# EAGLE design Power_2019_2 (EAGLE 9.6.2)
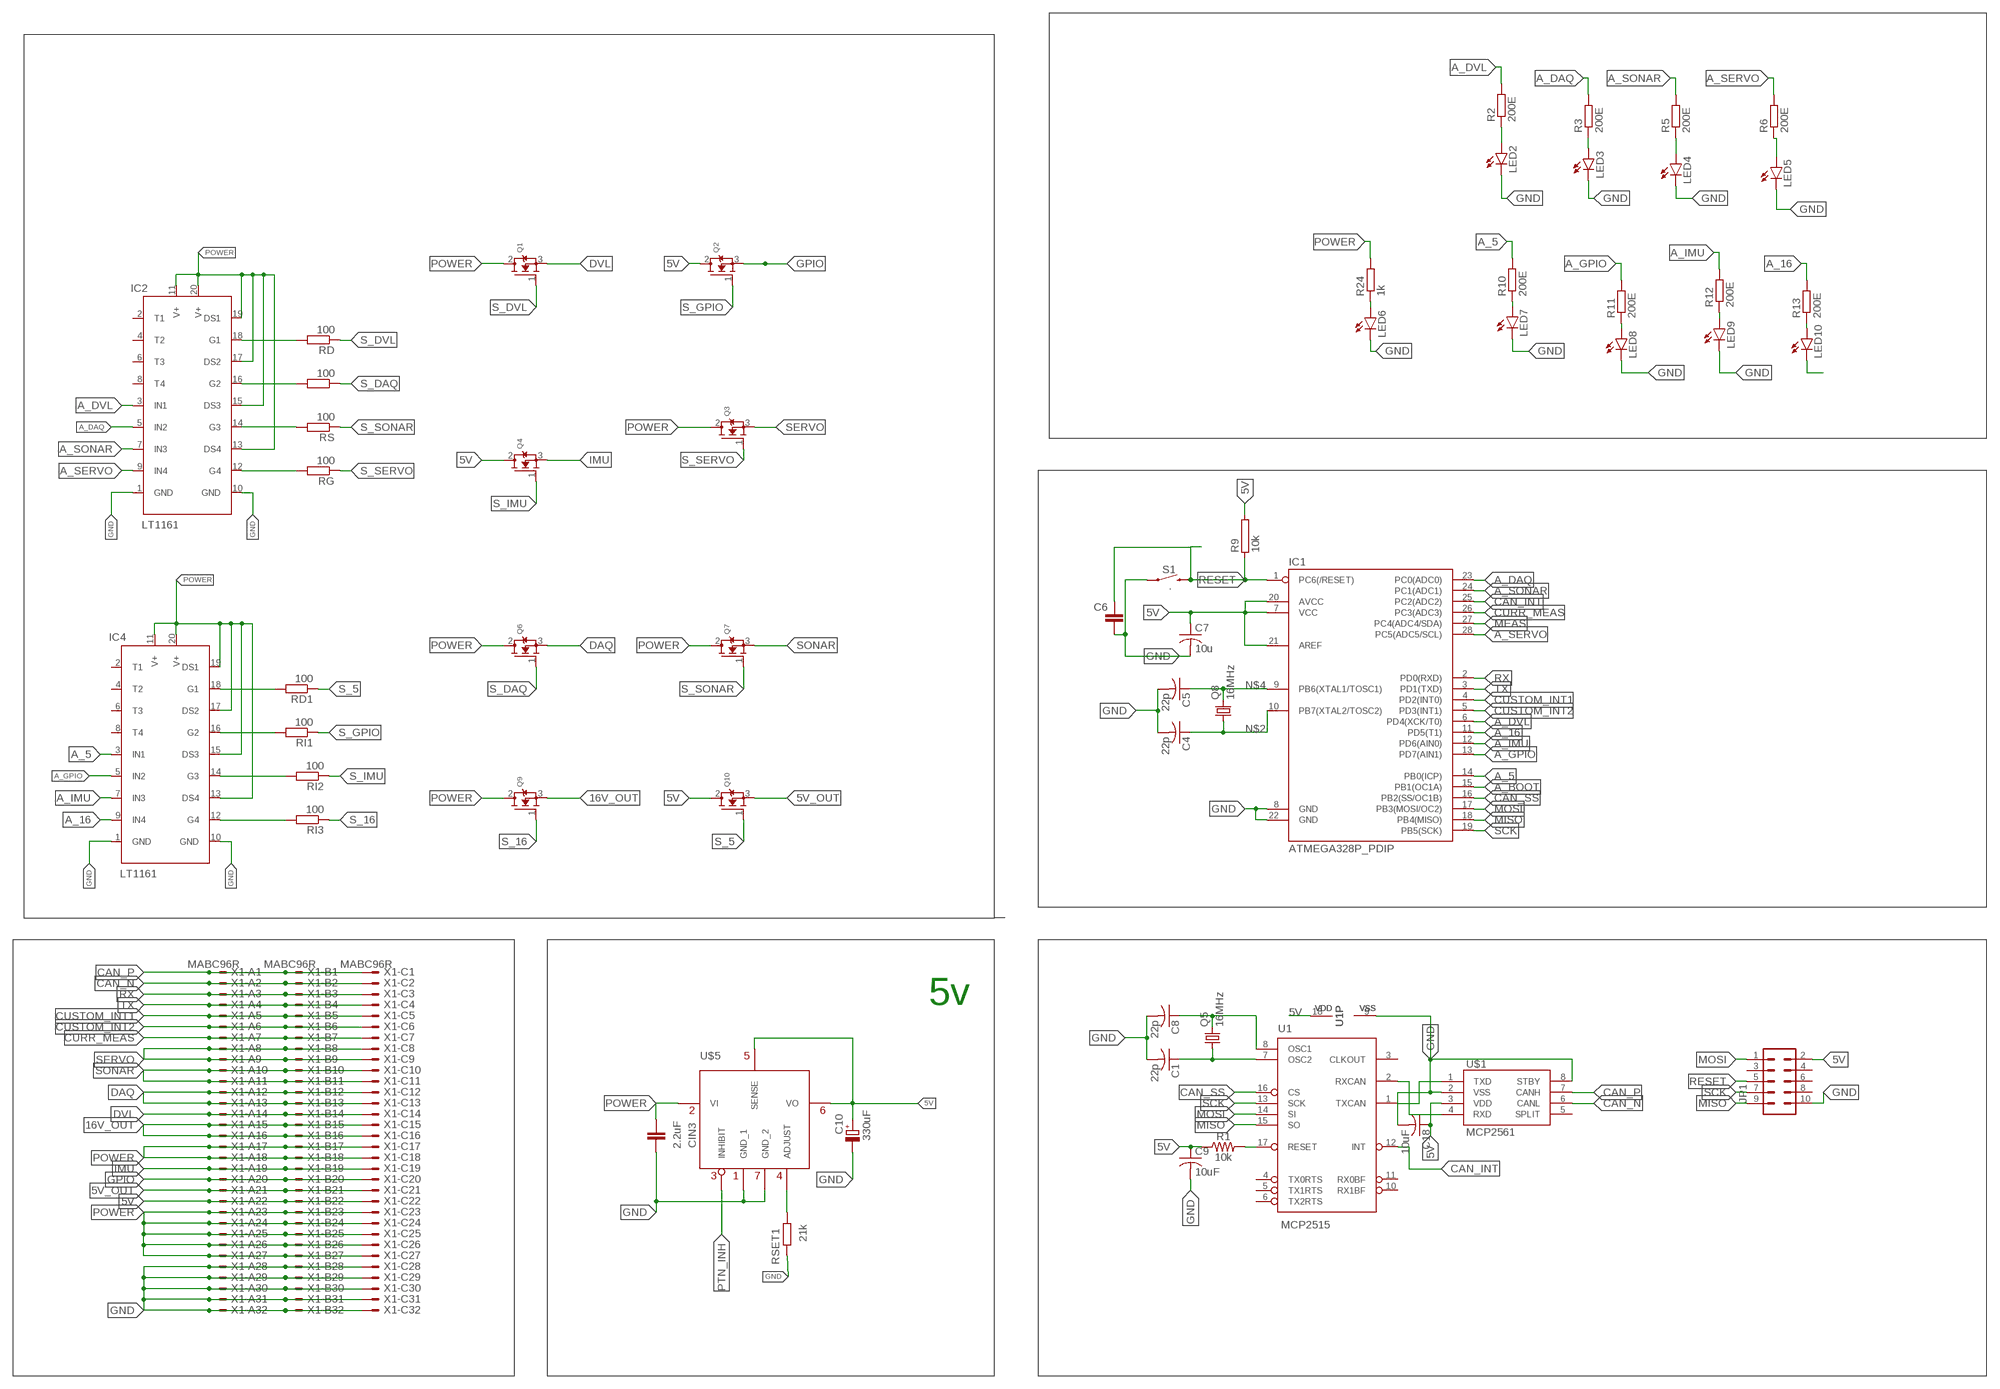
[diagram p0: schematic, sheet 1]

## Parts
C1  22p  C-US025-024X044  [C025-024X044]
C4  22p  C-US025-024X044  [C025-024X044]
C5  22p  C-US025-024X044  [C025-024X044]
C6  C-EU025-050X050  [C025-050X050]
C7  10u  C-US025-050X050  [C025-050X050]
C8  22p  C-US025-024X044  [C025-024X044]
C9  10uF  C-US025-050X050  [C025-050X050]
C10  330uF  CPOL-EUE2.5-5  [E2,5-5]
C18  10uF  C-US025-050X050  [C025-050X050]
CIN3  2.2uF  C-EUC0805  [C0805]
IC1  ATMEGA328P_PDIP  [DIL28-3]
IC2  LT1161  ROBOSUB_LINEAR-TECHNOLOGY_LT1161_QUAD-HIGH-SIDE-MOSFET-DRIVER_LT1161-SO20SW  [ROBOSUB_LINEAR-TECHNOLOGY_LT1161_QUAD-HIGH-SIDE-MOSFET-DRIVER_SO20]
IC4  LT1161  ROBOSUB_LINEAR-TECHNOLOGY_LT1161_QUAD-HIGH-SIDE-MOSFET-DRIVER_LT1161-SO20SW  [ROBOSUB_LINEAR-TECHNOLOGY_LT1161_QUAD-HIGH-SIDE-MOSFET-DRIVER_SO20]
JP1  CONN_05X2SHD  [2X5-SHROUDED]
LED2  LEDCHIPLED_0805  [CHIPLED_0805]
LED3  LEDCHIPLED_0805  [CHIPLED_0805]
LED4  LEDCHIPLED_0805  [CHIPLED_0805]
LED5  LEDCHIPLED_0805  [CHIPLED_0805]
LED6  LEDCHIPLED_0805  [CHIPLED_0805]
LED7  LEDCHIPLED_0805  [CHIPLED_0805]
LED8  LEDCHIPLED_0805  [CHIPLED_0805]
LED9  LEDCHIPLED_0805  [CHIPLED_0805]
LED10  LEDCHIPLED_0805  [CHIPLED_0805]
Q1  MOSFET-NGDS_TO220V  [TO220V]
Q2  MOSFET-NGDS_TO220V  [TO220V]
Q3  MOSFET-NGDS_TO220V  [TO220V]
Q4  MOSFET-NGDS_TO220V  [TO220V]
Q5  16MHz  CRYSTALHC49S  [HC49/S]
Q6  MOSFET-NGDS_TO220V  [TO220V]
Q7  MOSFET-NGDS_TO220V  [TO220V]
Q8  16MHz  CRYSTALHC49S  [HC49/S]
Q9  MOSFET-NGDS_TO220V  [TO220V]
Q10  MOSFET-NGDS_TO220V  [TO220V]
R1  10k  RESISTORAXIAL-0.3  [AXIAL-0.3]
R2  200E  R-EU_M0805  [M0805]
R3  200E  R-EU_M0805  [M0805]
R5  200E  R-EU_M0805  [M0805]
R6  200E  R-EU_M0805  [M0805]
R9  10k  RRS1/4  [RS1/4]
R10  200E  R-EU_M0805  [M0805]
R11  200E  R-EU_M0805  [M0805]
R12  200E  R-EU_M0805  [M0805]
R13  200E  R-EU_M0805  [M0805]
R24  1k  R-EU_M0805  [M0805]
RD  100  R-EU_M0805  [M0805]
RD1  100  R-EU_M0805  [M0805]
RG  100  R-EU_M0805  [M0805]
RI  100  R-EU_M0805  [M0805]
RI1  100  R-EU_M0805  [M0805]
RI2  100  R-EU_M0805  [M0805]
RI3  100  R-EU_M0805  [M0805]
RS  100  R-EU_M0805  [M0805]
RSET1  21k  R-EU_M0805  [M0805]
S1  .  MOMENTARY-SWITCH-SPST-PTH-6.0MM  [TACTILE_SWITCH_PTH_6.0MM]
U1  MCP2515  MCP2515(MCP2510)P  [DIP18]
U$1  MCP2561  [DIP08]
U$5  PTN78060WAH  [PTN78060WAH]
X1  MABC96R  [MABC96R]

## Nets
5V: C7.1 C9.1 C10.+ C18.1 IC1.7(VCC) IC1.20(AVCC) IC1.21(AREF) JP1.2 Q2.2(D) Q4.2(D) Q10.2(D) R1.P$1 R9.2 U1.18(VDD) U$1.3(VDD) U$5.5(SENSE) U$5.6(VO) X1.A22 X1.B22 X1.C22
5V_OUT: Q10.3(S) X1.A21 X1.B21 X1.C21
16V_OUT: Q9.3(S) X1.A15 X1.A16 X1.B15 X1.B16 X1.C15 X1.C16
A_5: IC1.14(PB0(ICP)) IC4.3(IN1) R10.2
A_16: IC1.11(PD5(T1)) IC4.9(IN4) R13.2
A_BOOT: IC1.15(PB1(OC1A))
A_DAQ: IC1.23(PC0(ADC0)) IC2.5(IN2) R3.2
A_DVL: IC1.6(PD4(XCK/T0)) IC2.3(IN1) R2.2
A_GPIO: IC1.13(PD7(AIN1)) IC4.5(IN2) R11.2
A_IMU: IC1.12(PD6(AIN0)) IC4.7(IN3) R12.2
A_SERVO: IC1.28(PC5(ADC5/SCL)) IC2.9(IN4) R6.2
A_SONAR: IC1.24(PC1(ADC1)) IC2.7(IN3) R5.2
CAN_INT: IC1.25(PC2(ADC2)) U1.12(INT)
CAN_N [can]: U$1.6(CANL) X1.A2 X1.B2 X1.C2
CAN_P [can]: U$1.7(CANH) X1.A1 X1.B1 X1.C1
CAN_SS: IC1.16(PB2(SS/OC1B)) U1.16(CS)
CURR_MEAS: IC1.26(PC3(ADC3)) X1.A7 X1.B7 X1.C7
CUSTOM_INT1: IC1.4(PD2(INT0)) X1.A5 X1.B5 X1.C5
CUSTOM_INT2: IC1.5(PD3(INT1)) X1.A6 X1.B6 X1.C6
D: IC2.12(G4) RG.2
DAQ: Q6.3(S) X1.A12 X1.A13 X1.B12 X1.B13 X1.C12 X1.C13
DVL: Q1.3(S) X1.A14 X1.B14 X1.C14
G: IC2.18(G1) RD.2
G1: IC4.18(G1) RD1.2
GND: C1.2 C4.2 C5.2 C6.2 C7.2 C8.2 C9.2 C10.- C18.2 CIN3.1 IC1.8(GND) IC1.22(GND) IC2.1(GND) IC2.10(GND) IC4.1(GND) IC4.10(GND) JP1.10 LED2.C LED3.C LED4.C LED5.C LED6.C LED7.C LED8.C LED9.C LED10.C RSET1.2 S1.1 U1.9(VSS) U$1.2(VSS) U$1.8(STBY) U$5.1(GND_1) U$5.7(GND_2) X1.A28 X1.A29 X1.A30 X1.A31 X1.A32 X1.B28 X1.B29 X1.B30 X1.B31 X1.B32 X1.C28 X1.C29 X1.C30 X1.C31 X1.C32
GPIO: Q2.3(S) X1.A20 X1.B20 X1.C20
I: IC2.14(G3) RS.2
IMU: Q4.3(S) X1.A19 X1.B19 X1.C19
MEAS: IC1.27(PC4(ADC4/SDA))
MISO: IC1.18(PB4(MISO)) JP1.9 U1.15(SO)
MOSI: IC1.17(PB3(MOSI/OC2)) JP1.1 U1.14(SI)
N$1: LED2.A R2.1
N$2: C4.1 IC1.10(PB7(XTAL2/TOSC2)) Q8.1
N$3: U1.1(TXCAN) U$1.1(TXD)
N$4: C5.1 IC1.9(PB6(XTAL1/TOSC1)) Q8.2
N$6: LED3.A R3.1
N$7: U1.2(RXCAN) U$1.4(RXD)
N$8: R1.P$2 U1.17(RESET)
N$9: C1.1 Q5.1 U1.7(OSC2)
N$10: C8.1 Q5.2 U1.8(OSC1)
N$11: RSET1.1 U$5.4(ADJUST)
N$13: LED4.A R5.1
N$15: LED5.A R6.1
N$17: LED7.A R10.1
N$18: LED6.A R24.1
N$21: LED8.A R11.1
N$23: LED9.A R12.1
N$25: LED10.A R13.1
N$29: IC4.14(G3) RI2.2
N$30: IC4.12(G4) RI3.2
POWER: CIN3.2 IC2.11(V+) IC2.13(DS4) IC2.15(DS3) IC2.17(DS2) IC2.19(DS1) IC2.20(V+) IC4.11(V+) IC4.13(DS4) IC4.15(DS3) IC4.17(DS2) IC4.19(DS1) IC4.20(V+) Q1.2(D) Q3.2(D) Q6.2(D) Q7.2(D) Q9.2(D) R24.2 U$5.2(VI) X1.A17 X1.A18 X1.A23 X1.A24 X1.A25 X1.A26 X1.A27 X1.B17 X1.B18 X1.B23 X1.B24 X1.B25 X1.B26 X1.B27 X1.C17 X1.C18 X1.C23 X1.C24 X1.C25 X1.C26 X1.C27
PTN_INH: U$5.3(INHIBIT)
RESET: C6.1 IC1.1(PC6(/RESET)) JP1.5 R9.1 S1.3
RX: IC1.2(PD0(RXD)) X1.A3 X1.B3 X1.C3
S: IC2.16(G2) RI.2
S1: IC4.16(G2) RI1.2
S_5: Q10.1(G) RD1.1
S_16: Q9.1(G) RI3.1
S_DAQ: Q6.1(G) RI.1
S_DVL: Q1.1(G) RD.1
S_GPIO: Q2.1(G) RI1.1
S_IMU: Q4.1(G) RI2.1
S_SERVO: Q3.1(G) RG.1
S_SONAR: Q7.1(G) RS.1
SCK: IC1.19(PB5(SCK)) JP1.7 U1.13(SCK)
SERVO: Q3.3(S) X1.A8 X1.A9 X1.B8 X1.B9 X1.C8 X1.C9
SONAR: Q7.3(S) X1.A10 X1.A11 X1.B10 X1.B11 X1.C10 X1.C11
TX: IC1.3(PD1(TXD)) X1.A4 X1.B4 X1.C4
Unconnected: IC2.2(T1) IC2.4(T2) IC2.6(T3) IC2.8(T4) IC4.2(T1) IC4.4(T2) IC4.6(T3) IC4.8(T4) JP1.3 JP1.4 JP1.6 JP1.8 U1.3(CLKOUT) U1.4(TX0RTS) U1.5(TX1RTS) U1.6(TX2RTS) U1.10(RX1BF) U1.11(RX0BF) U$1.5(SPLIT)

## Notes on the sheet
- 5v

## Library data of the parts
C1 C4 C5 C7 C8 = resistor:C-US: CAPACITOR, American symbol
C6 CIN3 = rcl:C-EU: CAPACITOR, European symbol; SPICEPREFIX: C
C9 C18 = adafruit:C-US: CAPACITOR, American symbol
C10 = rcl:CPOL-EU: POLARIZED CAPACITOR, European symbol
IC1 = SparkFun-DigitalIC:ATMEGA328P_PDIP: uC used in the Arduino 32kb flash, 1k EEPROM, 2k SRAM This is the through-hole version of this chip.
IC2 IC4 = LT1161:ROBOSUB_LINEAR-TECHNOLOGY_LT1161_QUAD-HIGH-SIDE-MOSFET-DRIVER_LT1161-SO20: Three Phase Bridge N-Channel MOSFET Driver 80V, 0.5A Source: http://www.intersil.com/data/fn/fn4220.pdf; MF: INTERSIL; MPN: HIP4086ABZ; OC_FARNELL: 1561974; OC_NEWARK: 20J4468
JP1 = SparkFun-Connectors:CONN_05X2: Multi connection point. Often used as Generic Header-pin footprint for 0.1 inch spaced/style header connections For AVR SPI programming port, see special device with nice symbol: "AVR_SPI_PROG_5x2.dev" You can populate with any combo of single row headers, but if you'd like an exact match, check these: 2x5 AVR ICSP Male Header <https://www.sparkfun.com/products/778> (PRT-00778) 2x5 Pin Shrouded Header <https://www.sparkfun.com/products/8506> (PRT-08506) On any of the 0.1 inch spaced packages, you can populate with these: Break Away Headers - Straight <https://www.sparkfun.com/products/116> (PRT-00116) Break Away Male Headers - Right Angle <https://www.sparkfun.com/products/553> (PRT-00553) Female Headers <https://www.sparkfun.com/products/115> (PRT-00115) Break Away Headers - Machine Pin <https://www.sparkfun.com/products/117> (PRT-00117) Break Away Female Headers - Swiss Machine Pin <https://www.sparkfun.com/products/743> (PRT-00743) Special note: the shrouded connector mates well with our 5x2 ribbon cables: 2x5 Pin IDC Ribbon Cable <https://www.sparkfun.com/products/8535> (PRT-08535); PROD_ID: CONN-08671; SF_ID: PRT-08506
LED2-LED10 = led:LED: LED OSRAM: - CHIPLED LG R971, LG N971, LY N971, LG Q971, LY Q971, LO R971, LY R971 LH N974, LH R974 LS Q976, LO Q976, LY Q976 LO Q996 - Hyper CHIPLED LW Q18S LB Q993, LB Q99A, LB R99A - SideLED LS A670, LO A670, LY A670, LG A670, LP A670 LB A673, LV A673, LT A673, LW A673 LH A674 LY A675 LS A676, LA A676, LO A676, LY A676, LW A676 LS A679, LY A679, LG A679 - Hyper Micro SIDELED® LS Y876, LA Y876, LO Y876, LY Y876 LT Y87S - SmartLED LW L88C, LW L88S LB L89C, LB L89S, LG L890 LS L89K, LO L89K, LY L89K LS L896, LA L896, LO L896, LY L896 - TOPLED LS T670, LO T670, LY T670, LG T670, LP T670 LSG T670, LSP T670, LSY T670, LOP T670, LYG T670 LG T671, LOG T671, LSG T671 LB T673, LV T673, LT T673, LW T673 LH T674 LS T676, LA T676, LO T676, LY T676, LB T676, LH T676, LSB T676, LW T676 LB T67C, LV T67C, LT T67C, LS T67K, LO T67K, LY T67K, LW E67C LS E67B, LA E67B, LO E67B, LY E67B, LB E67C, LV E67C, LT E67C LW T67C LS T679, LY T679, LG T679 LS T770, LO T770, LY T770, LG T770, LP T770 LB T773, LV T773, LT T773, LW T773 LH T774 LS E675, LA E675, LY E675, LS T675 LS T776, LA T776, LO T776, LY T776, LB T776 LHGB T686 LT T68C, LB T68C - Hyper Mini TOPLED® LB M676 - Mini TOPLED Santana® LG M470 LS M47K, LO M47K, LY M47K Source: http://www.osram.convergy.de LUXEON: - LUMILED® LXK2-PW12-R00, LXK2-PW12-S00, LXK2-PW14-U00, LXK2-PW14-V00 LXK2-PM12-R00, LXK2-PM12-S00, LXK2-PM14-U00 LXK2-PE12-Q00, LXK2-PE12-R00, LXK2-PE12-S00, LXK2-PE14-T00, LXK2-PE14-U00 LXK2-PB12-K00, LXK2-PB12-L00, LXK2-PB12-M00, LXK2-PB14-N00, LXK2-PB14-P00, LXK2-PB14-Q00 LXK2-PR12-L00, LXK2-PR12-M00, LXK2-PR14-Q00, LXK2-PR14-R00 LXK2-PD12-Q00, LXK2-PD12-R00, LXK2-PD12-S00 LXK2-PH12-R00, LXK2-PH12-S00 LXK2-PL12-P00, LXK2-PL12-Q00, LXK2-PL12-R00 Source: www.luxeon.com KINGBRIGHT: KA-3528ASYC Source: www.kingbright.com
Q1-Q4 Q6 Q7 Q9 Q10 = adafruit:MOSFET-N: N-Channel Mosfet 2N7002E - 60V 260mA SOT23 [Digikey: 2N7002ET1GOSTR-ND] - REEL BSH103 - 30V 850mA SOT23 [Digikey: 568-5013-1-ND]
Q5 Q8 = crystal:CRYSTAL: CRYSTAL; OC_FARNELL: 1667008; OC_NEWARK: unknown
R1 = SparkFun-Resistors:RESISTOR: Generic Resistor Package
R2 R3 R5 R6 R10-R13 R24 RD RD1 RG RI RI1-RI3 RS RSET1 = rcl:R-EU_: RESISTOR, European symbol; SPICEPREFIX: R
R9 = resistor-power:R: Power Resitor; MF: OHMITE; MPN: RRS1K0; OC_FARNELL: unknown; OC_NEWARK: 01F7661
S1 = SparkFun-Switches:MOMENTARY-SWITCH-SPST: Momentary Switch (Pushbutton) - SPST Normally-open (NO) SPST momentary switches (buttons, pushbuttons). Variants PTH-12MM - 12mm square, through-hole Momentary Pushbutton Switch - 12mm Square <https://www.sparkfun.com/products/9190> (COM-09190) PTH-6.0MM, PTH-6.0MM-KIT - 6.0mm square, through-hole Mini Pushbutton Switch <https://www.sparkfun.com/products/97> (COM-00097) KIT package intended for soldering kit's - only one side of pads' copper is exposed. PTH-RIGHT-ANGLE-KIT - Right-angle, through-hole Right Angle Tactile Button <https://www.sparkfun.com/products/10791> - Used on SparkFun BigTime Watch Kit <https://www.sparkfun.com/products/11734> SMD-12MM - 12mm square, surface-mount Tactile Button - SMD (12mm) <https://www.sparkfun.com/products/12993> (COM-12993) Used on SparkFun PicoBoard <https://www.sparkfun.com/products/11888> SMD-4.5MM - 4.5mm Square Trackball Switch Used on SparkFun Blackberry Trackballer Breakout <https://www.sparkfun.com/products/13169> SMD-4.6MMX2.8MM - 4.60mm x 2.80mm, surface mount Used on SparkFun SAMD21 Mini Breakout <https://www.sparkfun.com/products/13664> SMD-5.2MM, SMD-5.2-REDUNDANT - 5.2mm square, surface-mount Mini Pushbutton Switch - SMD <https://www.sparkfun.com/products/8720> (COM-08720) Used on Arduino Pro Mini <https://www.sparkfun.com/products/11114> REDUNDANT package connects both switch circuits together SMD-6.0X3.5MM - 6.0 x 3.5mm, surface mount Momentary Reset Switch SMD <https://www.sparkfun.com/products/8229> (COM-08229) SMD-6.2MM-TALL - 6.2mm square, surface mount Tactile Button - SMD (6mm) <https://www.sparkfun.com/products/12992> Used on SparkFun Digital Sandbox <https://www.sparkfun.com/products/12651> SMD-RIGHT-ANGLE - Right-angle, surface mount Used on SparkFun Block for Intel® Edison - Arduino <https://www.sparkfun.com/products/13036>; PROD_ID: SWCH-08441; SF_SKU: COM-00097
U1 = SparkFun-IC-Comms:MCP2515(MCP2510): CAN controller with SPI interface The MCP2515 controller supercedes the MCP2510 while addressing all errata associated with it. The two devices are pin compatible, either can be used with this device. 18-pin package SOIC Simple SPI interface to any MCU. One-shot mode ensures message transmission is attempted only once Databyte filtering Start-of-Frame (SOF) output Low-power CMOS Technology Datasheet <http://www.sparkfun.com/datasheets/DevTools/Arduino/MCP2515.pdf> SparkFun Products CAN-BUS Shield <https://www.sparkfun.com/products/13262> (DEV-13262); PROD_ID: NA-XXXXX
U$1 = LMZ22005TZ:MCP2561
U$5 = ptn78060wah:PTN78060WAH
X1 = con-vg:MABC96R: CONNECTOR male, 96 pins, type R, rows ABC, grid 2.54 mm; OC_FARNELL: unknown

## Net classes
1 can: clearance 0.406 mm

## Board
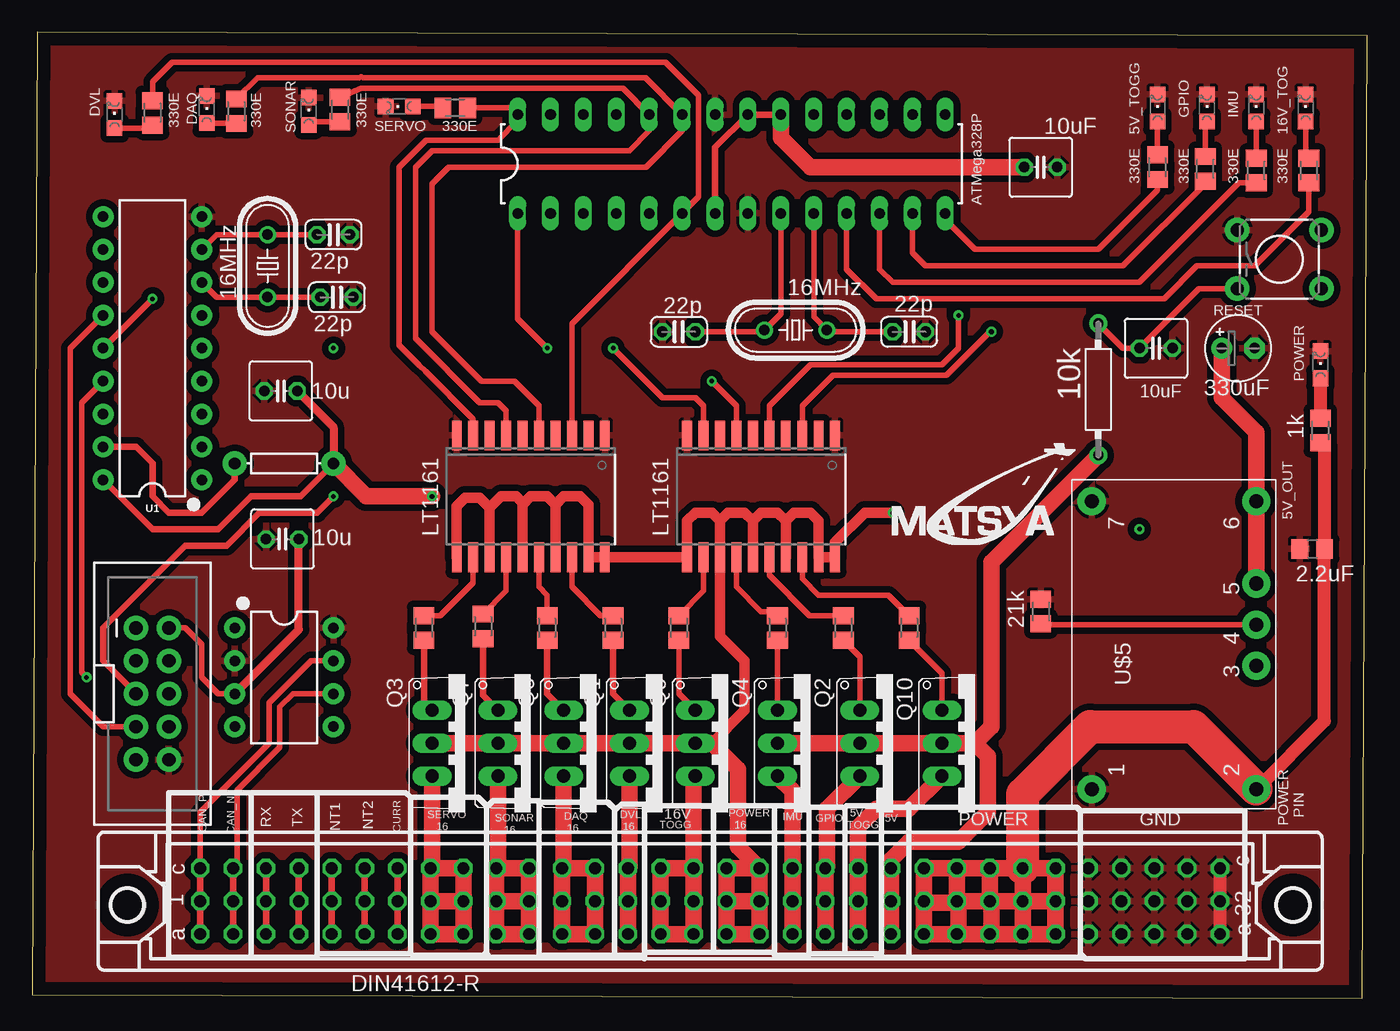
[diagram p1: board, top side]
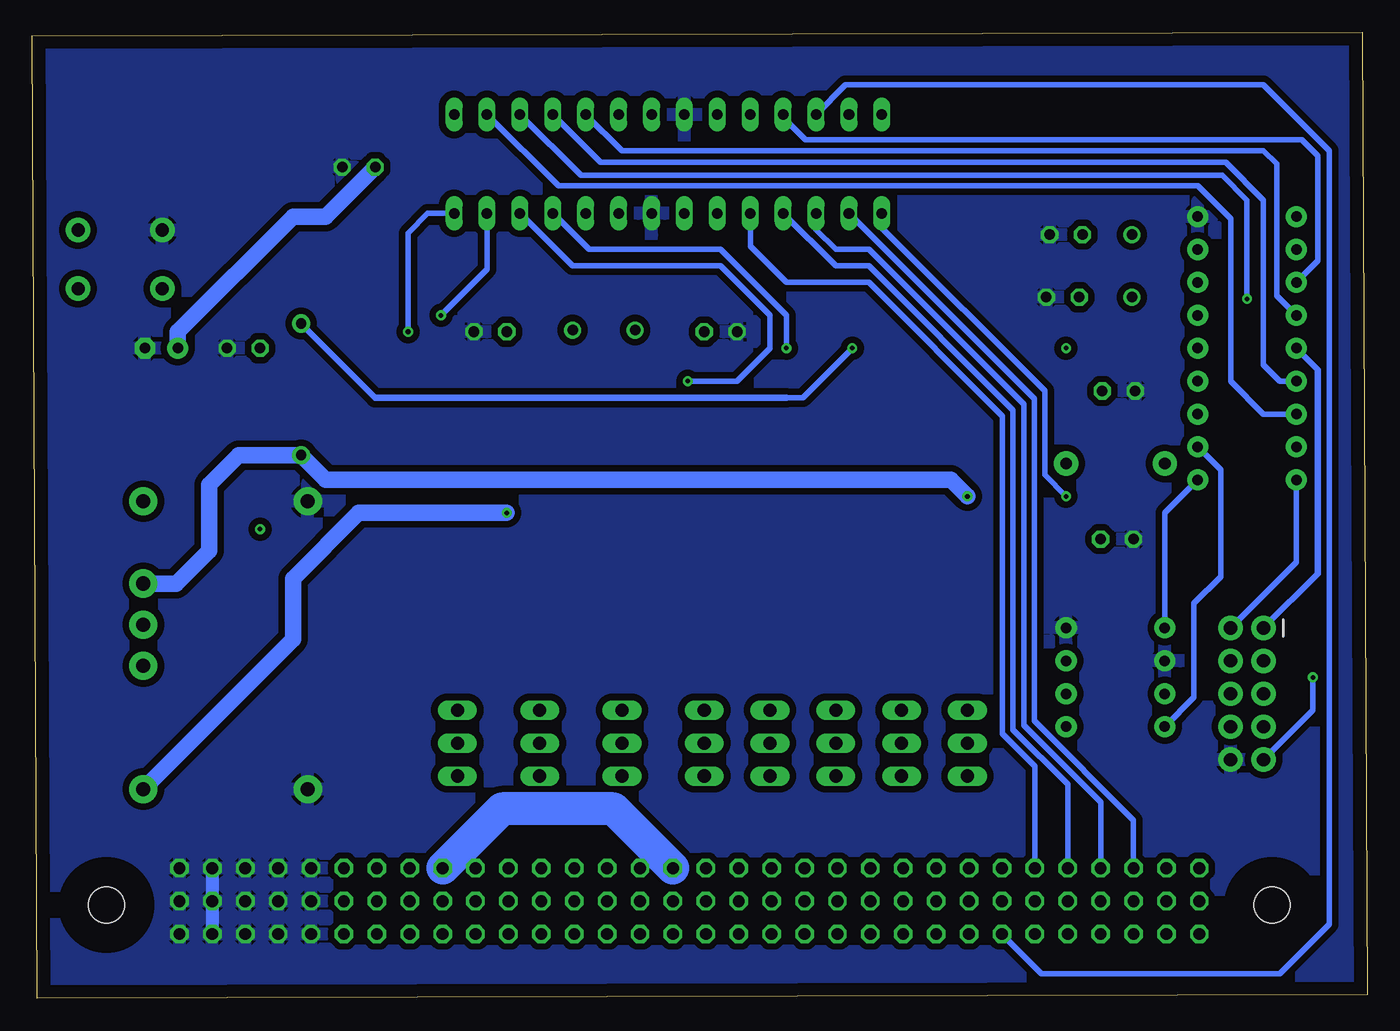
[diagram p2: board, bottom side, seen from below]

Size 103.05 x 74.54 mm. Coordinates in mm from the lower left corner, seen from the top.
Outline: 0,0.25 102.67,0 103.05,74.29 0.38,74.54 0,0.25
Copper layers (1*16): Top 0.035mm / dielectric 1.5mm / Bottom 0.035mm
Design rules "default *": minimum track width 6mil, minimum drill 0.35mm, track to track 16mil, track to pad 16mil, pad to pad 16mil, via to via 16mil, smd to smd 16mil, copper to edge 40mil, drill to drill 6mil, minimum pad ring 10mil, minimum via ring 8mil, stop-mask expansion 4mil, vias tented up to drill 0mil, thermal gap 10mil

### Footprints (pad centres in the part's own frame; a part is rotated, then mirrored left to right if it is on the bottom)
C025-024X044 = drill 0.813 octagon: 1 -1.27,0; 2 1.27,0
C025-050X050 = drill 0.813 octagon: 1 -1.27,0; 2 1.27,0
E2,5-5 = drill 0.813 pad 1.6: + -1.27,0 | drill 0.813 pad 1.6 octagon: - 1.27,0
C0805 = smd 1.3 x 1.5: 1 -0.95,0; 2 0.95,0
DIL28-3 = drill 0.813 long: 1 -16.51,-3.81; 2 -13.97,-3.81; 3 -11.43,-3.81; 4 -8.89,-3.81; 5 -6.35,-3.81; 6 -3.81,-3.81; 7 -1.27,-3.81; 8 1.27,-3.81; 9 3.81,-3.81; 10 6.35,-3.81; 11 8.89,-3.81; 12 11.43,-3.81; 13 13.97,-3.81; 14 16.51,-3.81; 15 16.51,3.81; 16 13.97,3.81; 17 11.43,3.81; 18 8.89,3.81; 19 6.35,3.81; 20 3.81,3.81; 21 1.27,3.81; 22 -1.27,3.81; 23 -3.81,3.81; 24 -6.35,3.81; 25 -8.89,3.81; 26 -11.43,3.81; 27 -13.97,3.81; 28 -16.51,3.81
ROBOSUB_LINEAR-TECHNOLOGY_LT1161_QUAD-HIGH-SIDE-MOSFET-DRIVER_SO20 = smd 0.762 x 2.286: 1 -5.715,-4.7; 2 -4.445,-4.7; 3 -3.175,-4.7; 4 -1.905,-4.7; 5 -0.635,-4.7; 6 0.635,-4.7; 7 1.905,-4.7; 8 3.175,-4.7; 9 4.445,-4.7; 10 5.715,-4.7; 11 5.715,4.7; 12 4.445,4.7; 13 3.175,4.7; 14 1.905,4.7; 15 0.635,4.7; 16 -0.635,4.7; 17 -1.905,4.7; 18 -3.175,4.7; 19 -4.445,4.7; 20 -5.715,4.7
2X5-SHROUDED = drill 1.016 pad 1.88: 1 -1.27,5.08; 2 1.27,5.08; 3 -1.27,2.54; 4 1.27,2.54; 5 -1.27,0; 6 1.27,0; 7 -1.27,-2.54; 8 1.27,-2.54; 9 -1.27,-5.08; 10 1.27,-5.08
CHIPLED_0805 = smd 1.2 x 1.2: A 0,-1.05; C 0,1.05
TO220V = drill 1.016 long: 1 -2.54,-2.54; 2 0,-2.54; 3 2.54,-2.54
HC49/S = drill 0.813: 1 -2.413,0; 2 2.413,0
AXIAL-0.3 = drill 0.9 pad 1.88: P$1 -3.81,0; P$2 3.81,0
M0805 = smd 1.3 x 1.6: 1 -0.95,0; 2 0.95,0
RS1/4 = drill 0.8 pad 1.4: 1 -5.08,0; 2 5.08,0
TACTILE_SWITCH_PTH_6.0MM = drill 1.016 pad 1.88: 1 -3.251,2.261; 2 3.251,2.261; 3 -3.251,-2.261; 4 3.251,-2.261
DIP18 = drill 0.813 pad 1.626: 1 -10.16,-3.81; 2 -7.62,-3.81; 3 -5.08,-3.81; 4 -2.54,-3.81; 5 0,-3.81; 6 2.54,-3.81; 7 5.08,-3.81; 8 7.62,-3.81; 9 10.16,-3.81; 10 10.16,3.81; 11 7.62,3.81; 12 5.08,3.81; 13 2.54,3.81; 14 0,3.81; 15 -2.54,3.81; 16 -5.08,3.81; 17 -7.62,3.81; 18 -10.16,3.81
DIP08 = drill 0.813 pad 1.626: 1 -3.81,-3.81; 2 -1.27,-3.81; 3 1.27,-3.81; 4 3.81,-3.81; 5 3.81,3.81; 6 1.27,3.81; 7 -1.27,3.81; 8 -3.81,3.81
PTN78060WAH = drill 1.1 pad 2.184: 1 -11.176,6.35; 2 -11.176,-6.35; 3 -1.651,-6.35; 4 1.524,-6.35; 5 4.699,-6.35; 6 11.049,-6.35; 7 11.049,6.35
MABC96R = drill 0.914 octagon: A1 -2.54,39.37; A2 -2.54,36.83; A3 -2.54,34.29; A4 -2.54,31.75; A5 -2.54,29.21; A6 -2.54,26.67; A7 -2.54,24.13; A8 -2.54,21.59; A9 -2.54,19.05; A10 -2.54,16.51; A11 -2.54,13.97; A12 -2.54,11.43; A13 -2.54,8.89; A14 -2.54,6.35; A15 -2.54,3.81; A16 -2.54,1.27; A17 -2.54,-1.27; A18 -2.54,-3.81; A19 -2.54,-6.35; A20 -2.54,-8.89; A21 -2.54,-11.43; A22 -2.54,-13.97; A23 -2.54,-16.51; A24 -2.54,-19.05; A25 -2.54,-21.59; A26 -2.54,-24.13; A27 -2.54,-26.67; A28 -2.54,-29.21; A29 -2.54,-31.75; A30 -2.54,-34.29; A31 -2.54,-36.83; A32 -2.54,-39.37; B1 0,39.37; B2 0,36.83; B3 0,34.29; B4 0,31.75; B5 0,29.21; B6 0,26.67; B7 0,24.13; B8 0,21.59; B9 0,19.05; B10 0,16.51; B11 0,13.97; B12 0,11.43; B13 0,8.89; B14 0,6.35; B15 0,3.81; B16 0,1.27; B17 0,-1.27; B18 0,-3.81; B19 0,-6.35; B20 0,-8.89; B21 0,-11.43; B22 0,-13.97; B23 0,-16.51; B24 0,-19.05; B25 0,-21.59; B26 0,-24.13; B27 0,-26.67; B28 0,-29.21; B29 0,-31.75; B30 0,-34.29; B31 0,-36.83; B32 0,-39.37; C1 2.54,39.37; C2 2.54,36.83; C3 2.54,34.29; C4 2.54,31.75; C5 2.54,29.21; C6 2.54,26.67; C7 2.54,24.13; C8 2.54,21.59; C9 2.54,19.05; C10 2.54,16.51; C11 2.54,13.97; C12 2.54,11.43; C13 2.54,8.89; C14 2.54,6.35; C15 2.54,3.81; C16 2.54,1.27; C17 2.54,-1.27; C18 2.54,-3.81; C19 2.54,-6.35; C20 2.54,-8.89; C21 2.54,-11.43; C22 2.54,-13.97; C23 2.54,-16.51; C24 2.54,-19.05; C25 2.54,-21.59; C26 2.54,-24.13; C27 2.54,-26.67; C28 2.54,-29.21; C29 2.54,-31.75; C30 2.54,-34.29; C31 2.54,-36.83; C32 2.54,-39.37 | hole 2.794: -0.305,45; -0.305,-45

### Placement (x,y rotation side)
C1  23.5,54.1 0 top
C4  67.69,51.43 0 top
C5  49.91,51.43 180 top
C6  86.74,50.16 0 top
C7  19.3,35.43 180 top
C8  23.24,58.93 0 top
C9  10u  [C025-050X050]  19.18,46.86 180 top
C10  93.09,50.16 0 top
C18  77.85,64.14 0 top
CIN3  98.81,34.67 0 top
IC1  53.98,64.39 0 top
IC2  38.48,38.73 180 top
IC4  56.26,38.73 180 top
JP1  9.27,23.5 0 top
LED2  6.35,68.2 0 top
LED3  13.46,68.58 0 top
LED4  21.34,68.45 0 top
LED5  28.32,68.83 90 top
LED6  99.44,48.89 0 top
LED7  86.87,68.71 0 top
LED8  90.68,68.71 0 top
LED9  94.49,68.71 0 top
LED10  98.3,68.71 0 top
Q1  48.64,19.69 270 top
Q2  66.42,19.69 270 top
Q3  33.4,19.69 270 top
Q4  60.07,19.69 270 top
Q5  18.16,56.52 90 top
Q6  43.56,19.69 270 top
Q7  38.48,19.69 270 top
Q8  58.93,51.56 180 top
Q9  53.72,19.69 270 top
Q10  72.77,19.69 270 top
R1  19.43,41.27 180 top
R2  9.27,68.33 90 top
R3  15.75,68.45 90 top
R5  23.75,68.58 90 top
R6  32.64,68.71 0 top
R9  82.3,46.99 270 top
R10  86.87,64.14 270 top
R11  90.55,64.01 270 top
R12  94.49,63.88 270 top
R13  98.55,63.88 270 top
R24  99.44,43.81 270 top
RD  44.83,28.58 90 top
RD1  67.69,28.58 90 top
RG  30.23,28.58 90 top
RI  39.75,28.58 90 top
RI1  62.61,28.58 90 top
RI2  57.53,28.58 90 top
RI3  49.91,28.58 90 top
RS  34.8,28.7 90 top
RSET1  77.85,29.85 90 top
S1  96.27,57.02 0 top
U1  9.27,50.16 90 top
U$1  19.43,24.77 270 top
U$5  88.14,27.31 90 top
X1  52.32,7.49 90 top

### Tracks (layer width: path | path; a pad name or v marks a point on that pad's centre or on a via)
5V  (via drill 0.35)
  Top 0.406: JP1.2 11.81,28.58 13.08,27.31 13.08,24.77 14.35,23.5 U$1.3
  Top 0.508: IC1.20 IC1.21 52.71,65.66 IC1.7 | U1.18 9.27,36.2 14.35,36.2 16.89,38.73 20.7,38.73 R1.P$1
  Top 0.61: U$1.3 20.57,28.45 C7.1 | C9.1 23.24,44.07 R1.P$1
  Top 1.27: X1.A22 X1.B22 X1.C22 66.29,10.67 67.69,12.06 71.5,12.06 73.79,14.35 73.79,18.67 72.77,19.69 | Q4.2 Q2.2 Q10.2 72.77,19.69 | U$5.5 U$5.6 94.49,43.69 91.82,46.35 C10.+ | R9.2 74.04,33.66 74.04,20.96 72.77,19.69 | IC1.20 57.79,66.42 60.07,64.14 C18.1 | v30.86,38.73 25.78,38.73 R1.P$1
  Bottom 0.406: JP1.2 5.46,33.66 U1.18
  Bottom 1.27: U$5.5 91.95,32 89.41,34.54 89.41,39.62 87.12,41.91 R9.2 80.39,40 32.13,40 v30.86,38.73 | C18.1 80.39,60.32 82.93,60.32 91.83,51.43 C10.+
5V_OUT
  Top 1.27: X1.A21 X1.B21 X1.C21 63.75,13.21 65.15,14.61 67.69,14.61 Q10.3
16V_OUT
  Top 1.27: X1.C16 X1.C15 X1.B15 X1.A15 X1.A16 X1.B16 X1.C16 | X1.C16 51.05,17.02 Q9.3
A_5  (via drill 0.35)
  Top 0.406: R10.2 86.87,62.36 82.3,57.78 72.77,57.78 70.48,60.07 IC1.14 | IC4.3 59.44,45.72 61.8,48.08 70.57,48.08 73.92,51.43 v74.04,51.43
  Bottom 0.406: v74.04,51.43 74.04,59.05 72.52,60.58 IC1.14
A_16  (via drill 0.35)
  Top 0.406: IC1.11 62.87,56.26 65.15,53.98 87.38,53.98 89.92,56.52 94.36,56.52 98.55,60.71 R13.2 | v44.83,50.16 48.64,46.35 51.18,46.35 51.82,45.72 IC4.9
  Bottom 0.406: IC1.11 60.07,57.78 49.91,57.78 44.83,52.7 v44.83,50.16
A_DAQ
  Top 0.406: R3.2 17.39,71.04 25.22,71.04 25.38,71.11 25.55,71.04 47.32,71.04 IC1.23 50.17,66.93 47.37,64.14 32.13,64.14 30.86,62.86 30.86,51.43 34.67,47.62 37.21,47.62 39.12,45.72 IC2.5
A_DVL
  Top 0.406: R2.2 9.27,70.73 10.79,72.25 48.88,72.25 51.44,69.7 51.44,61.85 IC1.6 41.66,52.07 IC2.3
A_GPIO  (via drill 0.35)
  Top 0.406: R11.2 90.55,62.86 84.2,56.52 68.96,56.52 67.94,57.53 IC1.13 | IC4.5 56.9,45.72 60.07,48.89 70.23,48.89 71.5,50.16 v71.5,52.7
  Bottom 0.406: IC1.13 67.94,56.26 v71.5,52.7
A_IMU  (via drill 0.35)
  Top 0.406: R12.2 93.16,62.93 85.47,55.24 66.42,55.24 65.41,56.26 IC1.12 | v52.45,47.62 54.36,45.72 IC4.7
  Bottom 0.406: IC1.12 61.34,56.52 49.91,56.52 46.1,52.7 46.1,50.16 48.64,47.62 v52.45,47.62
A_SERVO
  Top 0.406: R6.2 36.96,68.71 IC1.28 37.47,67.74 35.94,66.22 30.4,66.22 28.32,64.14 28.32,50.39 29.87,48.85 30.34,48.37 34.04,44.68 IC2.9
A_SONAR
  Top 0.406: R5.2 25.39,70.23 45.59,70.23 IC1.24 47.62,66.93 46.1,65.41 30.86,65.41 29.59,64.14 29.59,50.93 34.54,45.97 35.94,45.97 36.58,45.34 IC2.7
CAN_INT
  Bottom 0.406: IC1.25 45.09,68.01 43.35,66.27 5.05,66.27 3.81,65.02 3.81,56.9 U1.12
CAN_N
  Top 0.406: 15.79,10.33 15.79,16.05 19.1,19.36 19.1,22.48 20.12,23.5 U$1.6
  Top 0.508: X1.A2 X1.B2 X1.C2 15.79,10.33
CAN_P
  Top 0.406: X1.C1 12.95,14.36 18.29,19.69 18.29,22.82 21.51,26.04 U$1.7
  Top 0.508: X1.C1 X1.B1 X1.A1
CAN_SS
  Bottom 0.406: IC1.16 62.43,62.69 13.08,62.69 10.54,60.15 10.54,47.62 8,45.09 U1.16
CURR_MEAS
  Top 0.508: X1.C7 X1.B7 X1.A7
  Bottom 0.406: IC1.26 40.26,70.48 8,70.48 2.92,65.41 2.92,5.71 6.73,1.91 25.15,1.91 X1.A7
CUSTOM_INT1
  Top 0.508: X1.C5 X1.B5 X1.A5
  Bottom 0.406: IC1.4 41.02,56.52 38.48,56.52 27.33,45.36 27.33,20.73 23.11,16.52 X1.C5
CUSTOM_INT2
  Top 0.508: X1.C6 X1.B6 X1.A6
  Bottom 0.406: X1.C6 25.65,17.91 28.14,20.4 28.14,44.91 38.48,55.24 44.83,55.24 47.62,58.04 IC1.5
D
  Top 0.406: IC2.12 34.04,32.06 31.5,29.53 RG.2
DAQ
  Top 1.27: X1.C12 X1.B12 X1.A12 X1.A13 X1.B13 X1.C13 X1.C12 | Q6.3 41.02,10.16 X1.C12
DVL
  Top 1.27: X1.A14 X1.B14 X1.C14 46.1,10.16 Q1.3
G
  Top 0.406: IC2.18 41.66,31.75 43.88,29.53 RD.2
G1
  Top 0.406: IC4.18 59.44,32.38 60.71,31.12 66.1,31.12 RD1.2
GND
  Top 1.016: X1.C32 X1.B32 X1.A32
  Bottom 1.016: X1.C31 X1.B31 X1.A31
  pour Top (isolate 0.508): -0.89,75.57 -0.89,-0.64 108.33,-0.64 108.33,75.57
  pour Bottom (isolate 0.508): -2.16,76.84 -2.16,-4.45 -0.89,-5.71 112.14,-5.71 112.14,76.84 110.87,78.11 -0.89,78.11
GPIO
  Top 1.27: X1.A20 X1.B20 X1.C20 61.34,10.16 61.34,14.61 Q2.3
I
  Top 0.406: IC2.14 36.58,31.43 RS.2
IMU
  Top 1.27: X1.A19 X1.B19 X1.C19 58.67,16 Q4.3
MISO  (via drill 0.35)
  Top 0.406: U1.15 3.81,45.97 3.81,25.15 v4.19,24.77
  Bottom 0.406: v4.19,24.77 4.19,22.23 JP1.9 | IC1.18 59.18,64.52 10.92,64.52 8,61.59 8,48.89 6.73,47.62 U1.15
MOSI  (via drill 0.35)
  Top 0.406: v9.27,53.98 U1.14
  Bottom 0.406: IC1.17 60.71,63.5 11.18,63.5 9.27,61.59 v9.27,53.98
  Bottom 0.508: U1.14 3.81,48.51 3.81,32.77 JP1.1
N$1
  Top 0.406: R2.1 9.04,67.15 LED2.A
N$2
  Top 0.406: IC1.10 60.33,52.58 Q8.1 61.47,51.43 C4.1
N$3
  Bottom 0.406: U1.1 15.62,37.46 U$1.1
N$4
  Top 0.406: IC1.9 57.79,52.83 Q8.2 56.39,51.43 C5.1
N$5  (via drill 0.35)
  other vias: 85.47,36.2
N$6
  Top 0.406: R3.1 15.72,67.53 LED3.A
N$7
  Bottom 0.406: U1.2 11.3,40.77 11.3,32.54 13.36,30.49 13.36,23.22 U$1.4
N$8
  Top 0.508: R1.P$2 15.62,40 13.08,37.46 10.54,37.46 9.27,38.73 9.27,41.27 8,42.54 U1.17
N$9
  Top 0.406: C1.1 Q5.1 14.35,54.1 14.22,54.1 U1.7
N$10
  Top 0.406: U1.8 14.22,58.93 Q5.2 C8.1
N$11
  Top 0.406: RSET1.1 77.92,28.83 U$5.4
N$12  (via drill 0.35)
  other vias: 23.24,50.16
N$13
  Top 0.406: R5.1 21.56,67.63 LED4.A
N$15
  Top 0.406: LED5.A 31.56,68.83 R6.1
N$17
  Top 0.406: R10.1 LED7.A
N$18
  Top 1.016: LED6.A R24.1
N$21
  Top 0.406: R11.1 90.55,67.53 LED8.A
N$23
  Top 0.406: R12.1 LED9.A
N$25
  Top 0.406: R13.1 98.3,65.09 LED10.A
N$29
  Top 0.406: IC4.14 54.36,31.75 56.26,29.85 57.53,29.85 RI2.2
N$30
  Top 0.406: IC4.12 51.82,31.43 RI3.2
POWER  (via drill 0.35)
  Top 0.813: v66.42,37.46 64.26,37.46 61.98,35.18 IC4.20 IC4.19 60.71,36.83 60.07,37.46 58.8,37.46 58.17,36.83 | IC4.17 58.17,36.83 | 58.17,36.83 57.53,37.46 56.26,37.46 55.63,36.83 | 55.63,36.83 IC4.15 | 55.63,36.83 54.99,37.46 53.72,37.46 53.09,36.83 | 53.09,36.83 IC4.13 53.09,27.94 54.99,26.04 54.99,22.23 52.45,19.69 | 53.09,36.83 52.45,37.46 51.18,37.46 50.55,36.83 IC4.11 IC2.20 IC2.19 42.93,38.1 42.29,38.73 41.02,38.73 40.39,38.1 | 40.39,38.1 IC2.17 | 40.39,38.1 39.75,38.73 38.48,38.73 37.85,38.1 | 37.85,38.1 IC2.15 | 37.85,38.1 37.85,38.23 37.34,38.73 36.2,38.73 35.31,37.85 | 35.31,37.85 IC2.13 | 35.31,37.85 34.54,38.61 33.4,38.61 32.77,37.97 IC2.11
  Top 1.016: U$5.2 99.76,21.4 CIN3.2 99.76,42.55 R24.2
  Top 1.27: X1.C18 X1.C17 X1.B17 | X1.C18 X1.B18 | X1.B18 X1.B17 | X1.B17 X1.A17 X1.A18 X1.B18 | X1.B23 X1.C23 X1.C24 | X1.B23 X1.A23 X1.A24 | X1.A24 71.5,5.08 71.5,7.37 | 71.5,7.37 X1.B24 | X1.B23 68.96,7.37 71.5,7.37 | X1.B24 X1.C24 | X1.C24 X1.C25 | X1.C25 X1.B25 | X1.B24 X1.B25 | X1.A24 X1.A25 | X1.B25 74.04,7.37 | X1.A25 74.04,5.08 74.04,7.37 | X1.A25 X1.A26 | X1.A26 X1.B26 | X1.B26 74.17,7.49 74.04,7.37 | X1.C25 X1.C26 | X1.C26 X1.B26 | X1.C26 X1.C27 X1.B27 | X1.B27 X1.B26 | X1.B27 X1.A27 X1.A26 | X1.C18 54.48,11.68 54.48,17.65 52.45,19.69 Q9.2 Q1.2 Q6.2 Q7.2 Q3.2
  Top 2.54: X1.C26 76.45,15.75 81.66,20.96 89.66,20.96 U$5.2
  Bottom 1.27: U$5.2 82.93,27.69 82.93,32.38 77.85,37.46 v66.42,37.46
  Bottom 2.54: X1.C17 58.17,14.61 66.8,14.61 X1.C24
RESET  (via drill 0.35)
  Top 0.406: R9.1 84.2,50.16 C6.1 90.07,54.76 S1.3 | IC1.1 37.47,52.45 v39.75,50.16
  Top 0.508: v23.24,38.73 21.97,37.46 17.53,37.46 14.99,34.92 11.81,34.92 5.46,28.58 5.46,26.04 JP1.5
  Bottom 0.406: v23.24,38.73 24.89,40.39 24.89,46.86 37.47,59.44 IC1.1 | v39.75,50.16 43.56,46.35 44.83,46.35
  Bottom 0.508: 44.83,46.35 76.58,46.35 R9.1
RX
  Top 0.508: X1.C3 X1.B3 X1.A3
  Bottom 0.406: IC1.2 25.7,46.28 25.7,21.41 18.03,13.74 X1.C3
S
  Top 0.406: IC2.16 39.12,31.75 39.75,31.12 RI.2
S1
  Top 0.406: IC4.16 56.9,32.64 60.01,29.53 RI1.2
S_5
  Top 0.406: RD1.1 70.23,25.09 Q10.1
S_16
  Top 0.406: RI3.1 49.91,23.5 Q9.1
S_DAQ
  Top 0.508: RI.1 39.75,23.5 Q6.1
S_DVL
  Top 0.508: RD.1 44.83,23.5 Q1.1
S_GPIO
  Top 0.406: RI1.1 63.88,26.36 Q2.1
S_IMU
  Top 0.406: RI2.1 Q4.1
S_SERVO
  Top 0.508: RG.1 30.23,22.86 Q3.1
S_SONAR
  Top 0.508: RS.1 34.8,23.37 Q7.1
SCK
  Top 0.406: U1.13 2.92,50.16 2.92,23.5 5.46,20.96 JP1.7
  Bottom 0.406: IC1.19 57.53,65.41 8,65.41 6.98,64.39 6.98,54.23 U1.13
SERVO
  Top 1.27: X1.C8 X1.C9 X1.B9 | X1.C8 X1.B8 | X1.B8 X1.B9 | X1.B9 X1.A9 X1.A8 X1.B8 | Q3.3 30.86,10.16 X1.C8
SONAR
  Top 1.27: X1.C10 X1.C11 X1.B11 | X1.B11 X1.A11 X1.A10 X1.B10 | X1.B10 X1.C10 | X1.B10 X1.B11 | Q7.3 35.94,10.16 X1.C10
TX
  Top 0.508: X1.C4 X1.B4 X1.A4
  Bottom 0.406: X1.C4 20.57,15.13 26.52,21.07 26.52,45.82 38.48,57.78 41.02,57.78 42.55,59.31 IC1.3

### Text on the board
tNames: DVL | 330E | DAQ | 330E | 330E | GPIO | IMU | SONAR | SERVO | 330E | 5V_TOGG | 16V_TOG | 330E | 330E | 330E | 330E | ATMega328P | RESET | POWER | 10uF | 5V_OUT | RX | TX | 16V | IMU | GPIO | 5V | POWER | GND | POWER / PIN | CAN_P | CAN_N | INT1 | INT2 | CURR | SERVO / 16 | SONAR / 16 | DAQ / 16 | DVL / 16 | TOGG | POWER / 16 | 5V / TOGG